# Altium project GrandMini_v1.PrjPcb (part 1 of 2)
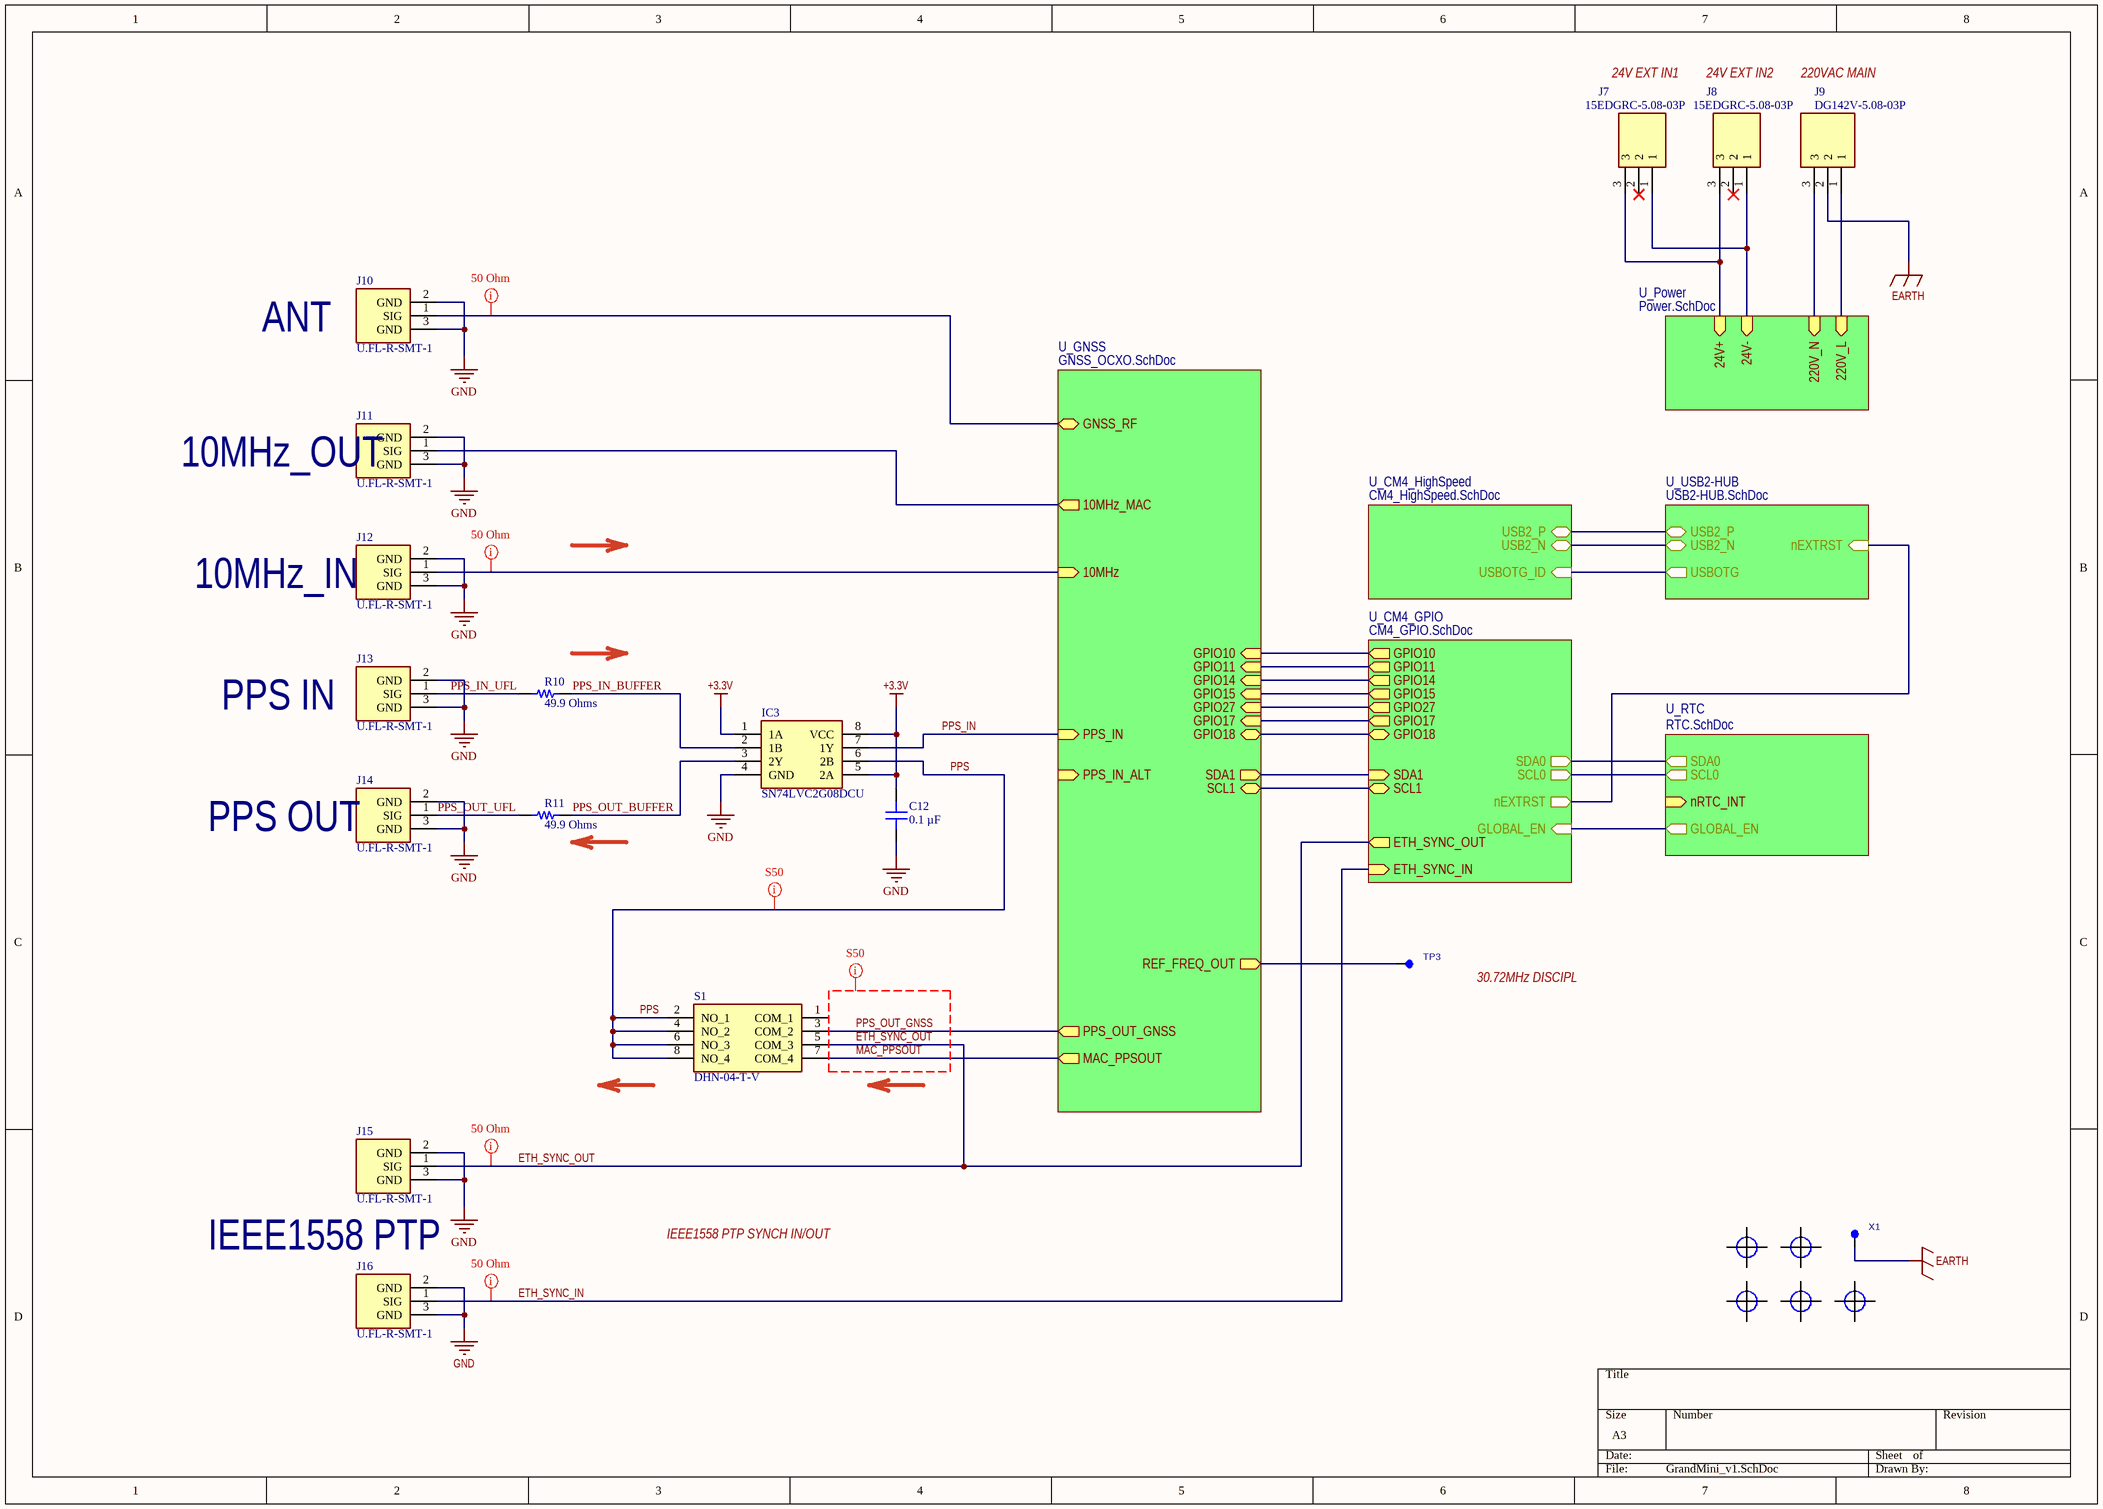
[diagram p0: GrandMini_v1.SchDoc]
company: SHIWA  NETWORK; revision: rev.1.0; TENSH_FAB: ТЕНШ.467883.02.11.000; TENSH_PCB: ТЕНШ.467883.02.11.001
4 sheets, 114 parts. Net scope: hierarchical (ports join the sheet entries above them; power ports are global).
Board file: GrandMini_v1.PcbDoc
Sheets:
  GrandMini_v1.SchDoc
    U_CM4_GPIO = CM4_GPIO.SchDoc
    U_CM4_HighSpeed = CM4_HighSpeed.SchDoc
    U_GNSS = GNSS_OCXO.SchDoc

## Sheet GrandMini_v1.SchDoc
size A3; DocumentNumber: 1; SheetNumber: 1

### Parts
C12  0.1 µF  [CAP 0603_1608]
IC3  SN74LVC2G08DCU  [SOP50P310X90-8N]
J7  15EDGRC-5.08-03P  [15EDGRC-5.08-03P]
J8  15EDGRC-5.08-03P  [15EDGRC-5.08-03P]
J9  DG142V-5.08-03P  [DG142V-5.08-03P]
J10  U.FL-R-SMT-1  [U.FL-R-SMT-1]
J11  U.FL-R-SMT-1  [U.FL-R-SMT-1]
J12  U.FL-R-SMT-1  [U.FL-R-SMT-1]
J13  U.FL-R-SMT-1  [U.FL-R-SMT-1]
J14  U.FL-R-SMT-1  [U.FL-R-SMT-1]
J15  U.FL-R-SMT-1  [U.FL-R-SMT-1]
J16  U.FL-R-SMT-1  [U.FL-R-SMT-1]
MNT1  MOUNT_HOLE  [MOUNT_3.5mm]  (value not drawn)  (no BOM)
MNT2  MOUNT_HOLE  [MOUNT_3.5mm]  (value not drawn)  (no BOM)
MNT4  MOUNT_HOLE  [MOUNT_3.5mm]  (value not drawn)  (no BOM)
MNT5  MOUNT_HOLE  [MOUNT_3.5mm]  (value not drawn)  (no BOM)
MNT6  MOUNT_HOLE  [MOUNT_3.5mm]  (value not drawn)  (no BOM)
R10  49.9 Ohms  [YAGEO RES 0603_1608]
R11  49.9 Ohms  [YAGEO RES 0603_1608]
S1  DHN-04-T-V  [DHN04TV]
TP3  30.72MHz  [PAD_TEST]  (value not drawn)  (no BOM)
X1  PAD  [POWERPAD_ROU_7/3.2]  (value not drawn)  (no BOM)

### Sub-sheets
U_CM4_GPIO = CM4_GPIO.SchDoc: GLOBAL_EN (in), SCL0 (out), SDA0 (out), nEXTRST (out), SDA1 (in), SCL1 (bidir), ETH_SYNC_IN (in), ETH_SYNC_OUT (out), GPIO10 (out), GPIO11 (out), GPIO14 (out), GPIO15 (out), GPIO27 (out), GPIO17 (out), GPIO18 (bidir)
U_CM4_HighSpeed = CM4_HighSpeed.SchDoc: USBOTG_ID (in), USB2_P (bidir), USB2_N (bidir)
U_GNSS = GNSS_OCXO.SchDoc: 10MHz (in), GNSS_RF (bidir), PPS_IN_ALT (in), PPS_IN (in), GPIO17 (in), GPIO27 (in), GPIO11 (in), GPIO10 (in), REF_FREQ_OUT (out), PPS_OUT_GNSS (out), MAC_PPSOUT (out), GPIO15 (in), GPIO14 (in), GPIO18 (bidir), SDA1 (out), SCL1 (bidir), 10MHz_MAC (out)
U_Power = Power.SchDoc (file not in this document): 220V_L (in), 220V_N (in), 24V+ (in), 24V- (in)
U_RTC = RTC.SchDoc (file not in this document): SCL0 (out), SDA0 (out), GLOBAL_EN (out), nRTC_INT (in)
U_USB2-HUB = USB2-HUB.SchDoc (file not in this document): USB2_N (bidir), USBOTG (out), USB2_P (bidir), nEXTRST (in)

### Nets
+3.3V: C12.2 IC3.1(1A) IC3.5(2A) IC3.8(VCC)
EARTH: J9.2 X1.1
GND: C12.1 IC3.4(GND) J10.2(GND) J10.3(GND) J11.2(GND) J11.3(GND) J12.2(GND) J12.3(GND) J13.2(GND) J13.3(GND) J14.2(GND) J14.3(GND) J15.2(GND) J15.3(GND) J16.2(GND) J16.3(GND)
10MHz: J12.1(SIG) ; sheet U_GNSS/10MHz
10MHz_MAC: J11.1(SIG) ; sheet U_GNSS/10MHz_MAC
ETH_SYNC_IN: J16.1(SIG) ; sheet U_CM4_GPIO/ETH_SYNC_IN
ETH_SYNC_OUT: J15.1(SIG) S1.5(COM_3) ; sheet U_CM4_GPIO/ETH_SYNC_OUT
GLOBAL_EN: sheet U_CM4_GPIO/GLOBAL_EN, sheet U_RTC/GLOBAL_EN
GNSS_RF_IN: J10.1(SIG) ; sheet U_GNSS/GNSS_RF
GPIO10: sheet U_CM4_GPIO/GPIO10, sheet U_GNSS/GPIO10
GPIO11: sheet U_CM4_GPIO/GPIO11, sheet U_GNSS/GPIO11
GPIO14: sheet U_CM4_GPIO/GPIO14, sheet U_GNSS/GPIO14
GPIO15: sheet U_CM4_GPIO/GPIO15, sheet U_GNSS/GPIO15
GPIO17: sheet U_CM4_GPIO/GPIO17, sheet U_GNSS/GPIO17
GPIO18: sheet U_CM4_GPIO/GPIO18, sheet U_GNSS/GPIO18
GPIO27: sheet U_CM4_GPIO/GPIO27, sheet U_GNSS/GPIO27
MAC_PPSOUT: S1.7(COM_4) ; sheet U_GNSS/MAC_PPSOUT
nEXTRST: sheet U_CM4_GPIO/nEXTRST, sheet U_USB2-HUB/nEXTRST
PPS: IC3.6(2B) S1.2(NO_1) S1.4(NO_2) S1.6(NO_3) S1.8(NO_4)
PPS_IN: IC3.7(1Y) ; sheet U_GNSS/PPS_IN
PPS_IN_BUFFER: IC3.2(1B) R10.2
PPS_IN_UFL: J13.1(SIG) R10.1
PPS_OUT_BUFFER: IC3.3(2Y) R11.2
PPS_OUT_GNSS: S1.3(COM_2) ; sheet U_GNSS/PPS_OUT_GNSS
PPS_OUT_UFL: J14.1(SIG) R11.1
REF_FREQ_OUT: TP3.1 ; sheet U_GNSS/REF_FREQ_OUT
SCL0: sheet U_CM4_GPIO/SCL0, sheet U_RTC/SCL0
SCL1: sheet U_CM4_GPIO/SCL1, sheet U_GNSS/SCL1
SDA0: sheet U_CM4_GPIO/SDA0, sheet U_RTC/SDA0
SDA1: sheet U_CM4_GPIO/SDA1, sheet U_GNSS/SDA1
USB2_N: sheet U_CM4_HighSpeed/USB2_N, sheet U_USB2-HUB/USB2_N
USB2_P: sheet U_CM4_HighSpeed/USB2_P, sheet U_USB2-HUB/USB2_P
USBOTG_ID: sheet U_CM4_HighSpeed/USBOTG_ID, sheet U_USB2-HUB/USBOTG
NetJ7_1: J7.1 J8.1 ; sheet U_Power/24V-
NetJ7_3: J7.3 J8.3 ; sheet U_Power/24V+
NetJ9_1: J9.1 ; sheet U_Power/220V_L
NetJ9_3: J9.3 ; sheet U_Power/220V_N

Not connected (* = marked no-connect by the designer): J7 2*; J8 2*; S1 1(COM_1)

### Layout directives
net class RF: 10MHz, ETH_SYNC_IN, ETH_SYNC_OUT, GNSS_RF_IN
net class S50: ETH_SYNC_OUT, MAC_PPSOUT, PPS, PPS_OUT_GNSS

### Notes on the sheet
- 24V EXT IN1
- 24V EXT IN2
- 220VAC MAIN
- ANT
- (near J11) 10MHz_OUT
- (near J12) 10MHz_IN
- PPS IN
- (near J14) PPS OUT
- (near TP3) 30.72MHz DISCIPL
- IEEE1558 PTP
- IEEE1558 PTP SYNCH IN/OUT
- 1
- 2
- 3
- 4
- 5
- 6
- A
- B
- C
- www.raspberrypi.com <http://www.raspberrypi.com>
- D
- Title: Compute Module 4 IO Board - Top Level
- File: CM4IOv5.kicad_sch
- Sheet: /
- © 2020-2022 Raspberry Pi Ltd (formerly Raspberry Pi (Trading) Ltd.)
- KiCad E.D.A.  kicad (5.1.4)-1
- Size: A4
- Date:
- Rev: 1
- Id: 1/1

### Library data of the parts
C12 = CC0603KRX7R9BB104: CAP CER 0.1UF 50V X7R 0603; manufacturer: Yageo; Tolerance: ±10%; componentlink2url: https://www.digikey.com/en/products/detail/yageo/CC0603KRX7R9BB104/2103082; Value: 0.1 µF; componentlink2description: DigiKey Link; Temperature Coefficient: X7R; Capacitance: 0.1 µF; Part Number: CC0603KRX7R9BB104; Applications: General Purpose; componentlink1description: Datasheet; componentlink1url: https://www.yageo.com/upload/media/product/productsearch/datasheet/mlcc/UPY-GPHC_X7R_6.3V-to-50V_18.pdf; Device Package: 0603 (1608 Metric); lastupdated: 09.02.2024 20:10:21; Lifecycle Status: Active; Minimum Order: 1; Mounting Type: Surface Mount, MLCC; Operating Temperature: -55°C ~ 125°C; Package / Case: 0603 (1608 Metric); packaging: TapeAndReel; partid: 9506; Part Status: Active; price: 0.01; series: CC; Size / Dimension: 0.063" L x 0.031" W (1.60mm x 0.80mm); Supplier 1: DigiKey; Supplier Part Number 1: 311-1344-1-ND; Thickness (Max): 0.035" (0.90mm); Voltage - Rated: 50V
IC3 = SN74LVC2G08DCU: Integrated Circuit; Manufacturer_Name: Texas Instruments; Datasheet Link: https://datasheet.datasheetarchive.com/originals/distributors/Datasheets-SFU2/DSASFU100028333.pdf; Height: 0.9mm; Manufacturer_Part_Number: SN74LVC2G08DCU
J7 J8 = 15EDGRC-5.08-03P: Connector; Manufacturer_Name: Degson; Manufacturer_Part_Number: 15EDGRC-5.08-02P-14-00A(H); Height: 7.24mm
J9 = DG142V-5.08-03P_1: Connector; pin to pad: 1>1+4 2>2+5 3>3+6; Manufacturer_Name: Degson; Manufacturer_Part_Number: DG142V-5.08-02P; Datasheet Link: https://oss.degson.com/upload/pdf/20211003/20211003190604_7549.pdf; Height: 14.1mm
J10-J16 = U.FL-R-SMT-1: Connector; Manufacturer_Name: Hirose; Height: 1.5; Manufacturer_Part_Number: U.FL-R-SMT-1
MNT1 MNT2 MNT4-MNT6 = MOUNT_HOLE: Mount hole
R10 R11 = RC0603FR-0749R9L: RES 49.9 OHM 1% 1/10W 0603; Manufacturer: Yageo; Power (Watts): 0.1W, 1/10W; Temperature Coefficient: ±100ppm/°C; Packaging: CutTape; ComponentLink2Description: DigiKey Link; ComponentLink1Description: Datasheet; ComponentLink2URL: https://www.digikey.com/en/products/detail/yageo/RC0603FR-0749R9L/727264; ComponentLink1URL: https://www.yageo.com/upload/media/product/productsearch/datasheet/rchip/PYu-RC_Group_51_RoHS_L_10.pdf; Part Number: RC0603FR-0749R9L; Value: 49.9 Ohms; Composition: Thick Film; Device Package: 0603 (1608 Metric); Features: Moisture Resistant; Height - Seated (Max): 0.022" (0.55mm); LastUpdated: 25.07.2024 9:19:17; Lifecycle Status: Active; Minimum Order: 1; Number of Terminations: 2; Operating Temperature: -55°C ~ 155°C; Package / Case: 0603 (1608 Metric); PartId: 23951; Part Status: Active; Price: 0.01; Resistance: 49.9 Ohms; Series: RC_L; Size / Dimension: 0.063" L x 0.031" W (1.60mm x 0.80mm); Supplier 1: DigiKey; Supplier Part Number 1: 311-49.9HRCT-ND; Supplier Device Package: 0603; Tolerance: ±1%
S1 = DHN-04-T-V: Switch; Manufacturer_Name: Diptronics; Datasheet Link: https://componentsearchengine.com/Datasheets/1/DHN-04-T-V.pdf; Height: 1.65mm; Manufacturer_Part_Number: DHN-04-T-V; Mouser Part Number: 113-DHN04TV; Mouser Price/Stock: https://www.mouser.co.uk/ProductDetail/Diptronics/DHN-04-T-V?qs=MLItCLRbWswbt%252B1%2FkyC9JQ%3D%3D
TP3 = PAD_TEST: Test Point; Manufacturer: {Manufacturer}; Reseller3: {Reseller3}; Reseller1: {Reseller1}; Tempcoeff: {Tempcoeff}; Reseller2: {Reseller2}; Tolerance: {Tolerance}; Value: .NetName; PowerVoltage: {PowerVoltage}; CatalogueCode: {CatalogueCode}; Case: {Case}
X1 = PAD: Power Pad; Manufacturer: {Manufacturer}; Reseller3: {Reseller3}; Reseller1: {Reseller1}; Tempcoeff: {Tempcoeff}; Reseller2: {Reseller2}; Tolerance: {Tolerance}; Value: {Value}; PowerVoltage: {PowerVoltage}; CatalogueCode: {CatalogueCode}; Case: {Case}

## Sheet CM4_GPIO.SchDoc
size A3; DocumentNumber: 2; SheetNumber: 2
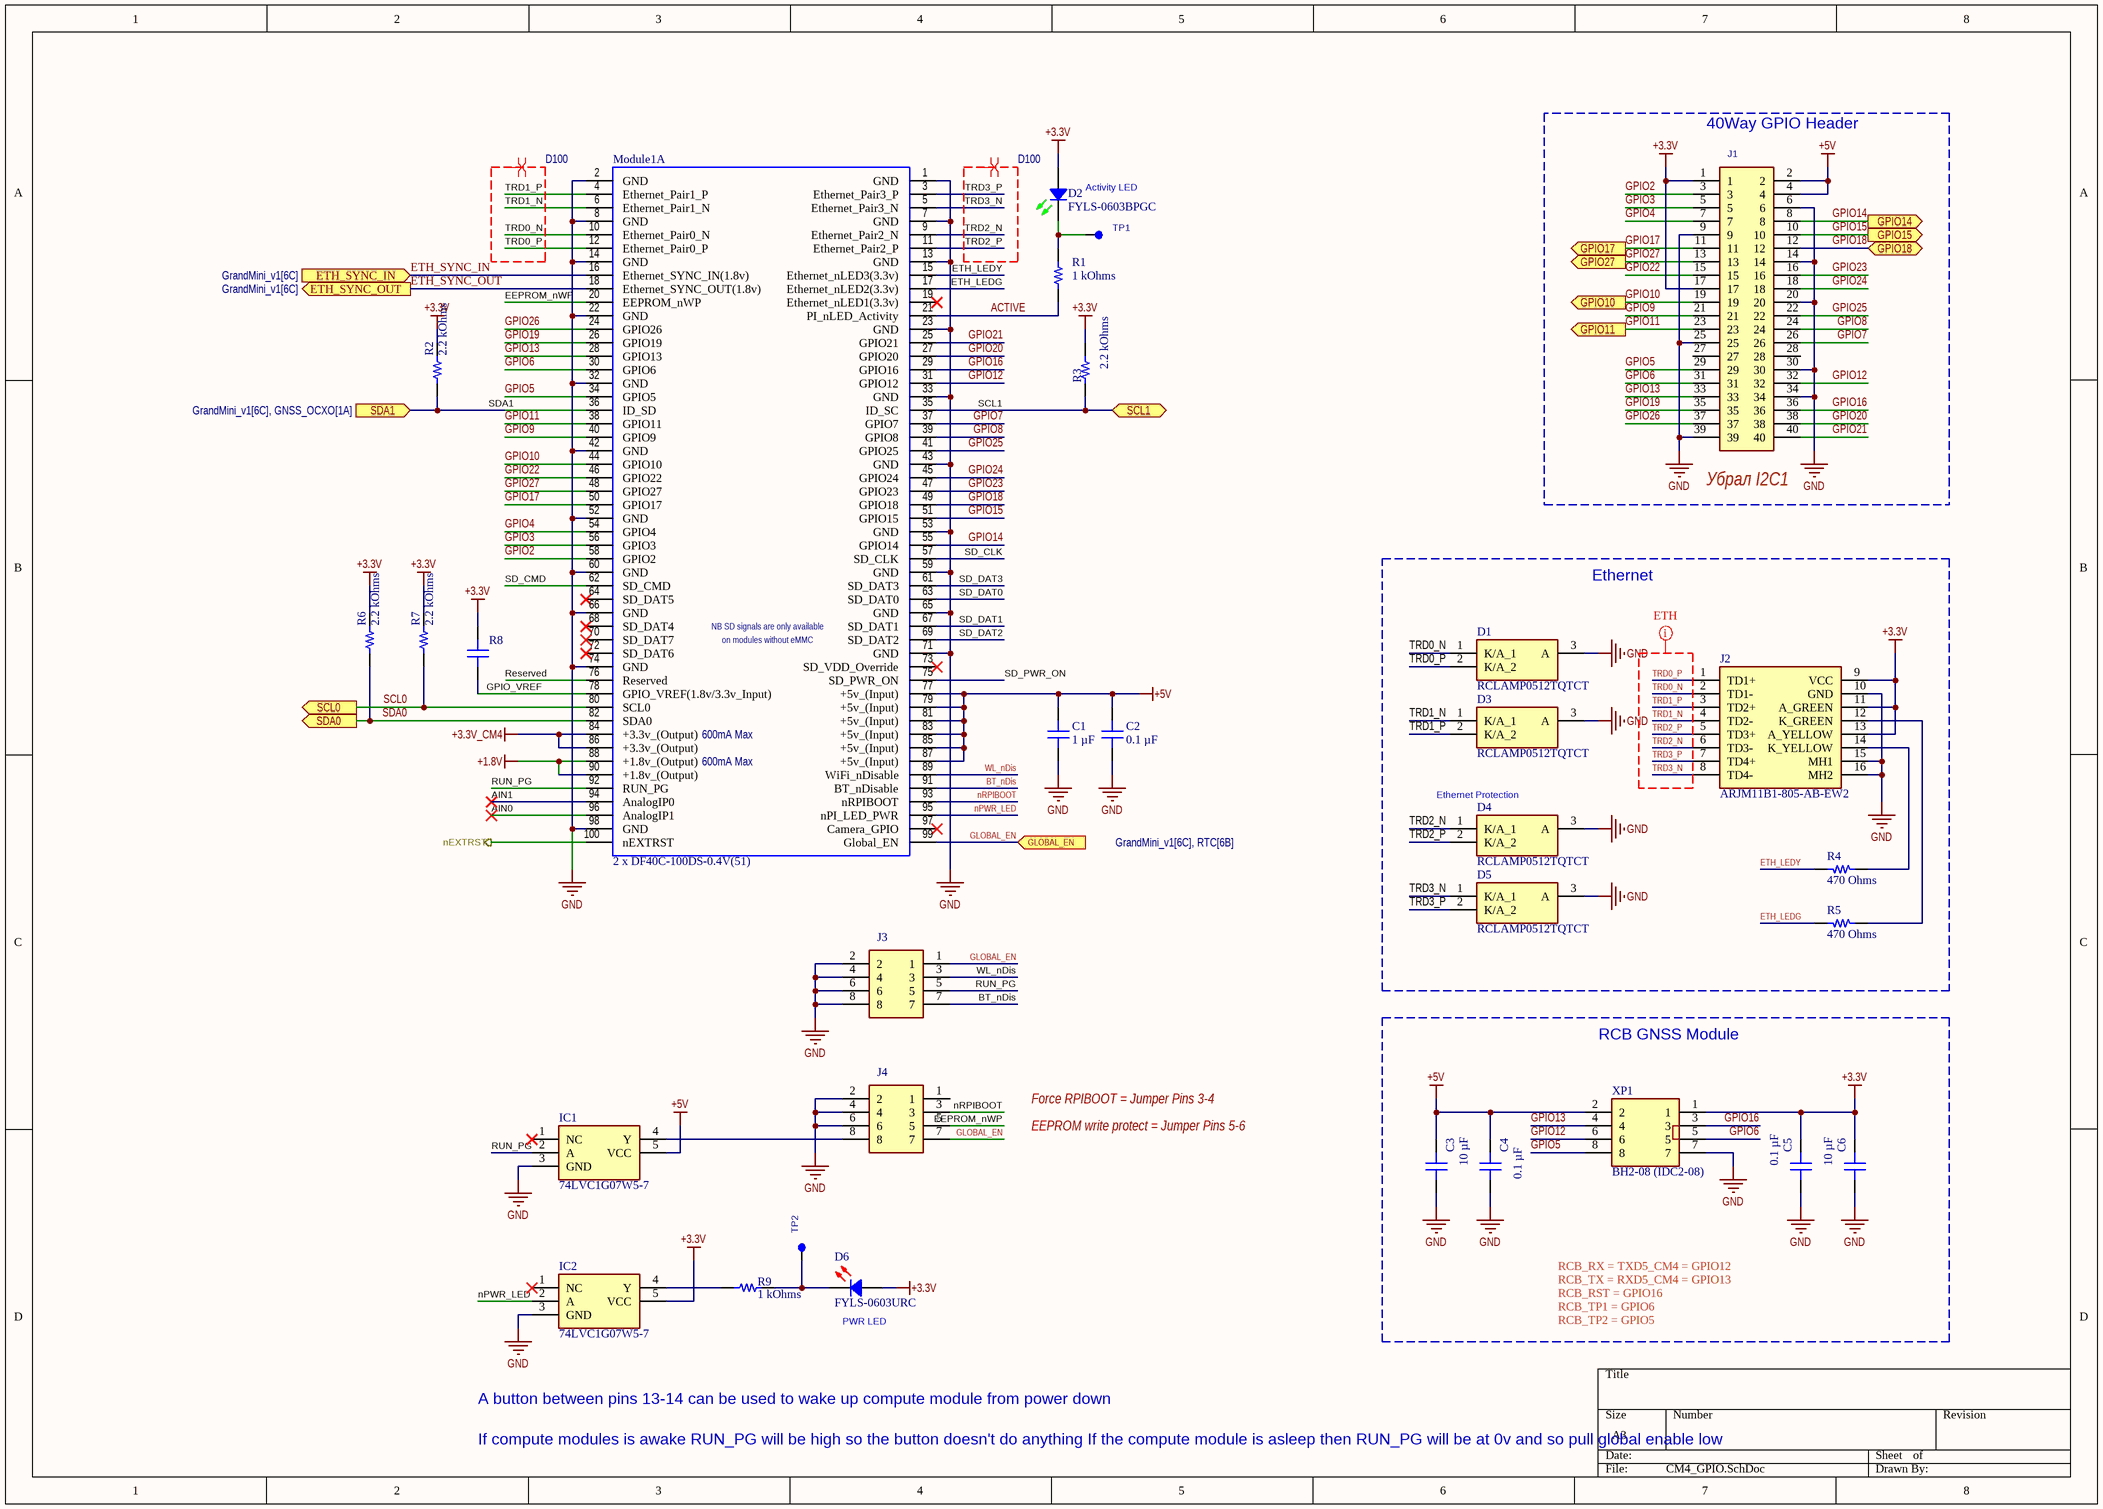
[diagram p1: CM4_GPIO.SchDoc]

### Parts
C1  1 µF  [CAP 0603_1608]
C2  0.1 µF  [CAP 0603_1608]
C3  10 µF  [CAP 0805_2012]
C4  0.1 µF  [CAP 0603_1608]
C5  0.1 µF  [CAP 0603_1608]
C6  10 µF  [CAP 0805_2012]
D1  RCLAMP0512TQTCT  [RCLAMP0512TQTCT]
D2  FYLS-0603BPGC  [LEDC1608X55N_GREEN]
D3  RCLAMP0512TQTCT  [RCLAMP0512TQTCT]
D4  RCLAMP0512TQTCT  [RCLAMP0512TQTCT]
D5  RCLAMP0512TQTCT  [RCLAMP0512TQTCT]
D6  FYLS-0603URC  [LEDC1608X55N_RED]
IC1  74LVC1G07W5-7  [SOT95P285X140-5N]
IC2  74LVC1G07W5-7  [SOT95P285X140-5N]
J1  PBD-40  [PBD-40]  (value not drawn)
J2  ARJM11B1-805-AB-EW2  [ARJM11B1805ABEW2]
J3  PLD-8  [PLD-8]  (value not drawn)
J4  PLD-8  [PLD-8]  (value not drawn)
Module1  2 x DF40C-100DS-0.4V(51)  [RPI_CM4_STACKED]  (part A of 2)
R1  1 kOhms  [YAGEO RES 0603_1608]
R2  2.2 kOhms  [YAGEO RES 0402_1005]
R3  2.2 kOhms  [YAGEO RES 0402_1005]
R4  470 Ohms  [YAGEO RES 0402_1005]
R5  470 Ohms  [YAGEO RES 0402_1005]
R6  2.2 kOhms  [YAGEO RES 0402_1005]
R7  2.2 kOhms  [YAGEO RES 0402_1005]
R8  10 µF  [CAP 0805_2012]  (value not drawn)
R9  1 kOhms  [YAGEO RES 0603_1608]
TP1  PAD_TEST  [PAD_TEST]  (value not drawn)  (no BOM)
TP2  PAD_TEST  [PAD_TEST]  (value not drawn)  (no BOM)
XP1  BH2-08 (IDC2-08)  [BH2-08]

### Blocks framed on the sheet
Убрал I2C1: J1
Ethernet: D1 D3-D5 J2 R4 R5
RCB GNSS Module: C3-C6 XP1

### Ports
ETH_SYNC_IN (in, see GrandMini_v1[6C]), ETH_SYNC_OUT (out, see GrandMini_v1[6C]), GLOBAL_EN (in, see GrandMini_v1[6C], RTC[6B]), GPIO10 (out, see GrandMini_v1[6B], GNSS_OCXO[3A]), GPIO11 (out, see GrandMini_v1[6B], GNSS_OCXO[3A]), GPIO14 (out, see GrandMini_v1[6B], GNSS_OCXO[3A]), GPIO15 (out, see GrandMini_v1[6B], GNSS_OCXO[3A]), GPIO17 (out, see GrandMini_v1[6B], GNSS_OCXO[1B]), GPIO18 (bidir, see GrandMini_v1[6B], GNSS_OCXO[3A]), GPIO27 (out, see GrandMini_v1[6B], GNSS_OCXO[1B]), nEXTRST (out, see GrandMini_v1[6C], USB2-HUB[1B]), SCL0 (out, see GrandMini_v1[6C], RTC[3A]), SCL1 (bidir, see GrandMini_v1[6C], GNSS_OCXO[1A]), SDA0 (out, see GrandMini_v1[6C], RTC[3B]), SDA1 (in, see GrandMini_v1[6C], GNSS_OCXO[1A])

### Nets
+1.8V: Module1.88(+1.8v_(Output)) Module1.90(+1.8v_(Output))
+3.3V: C5.2 C6.2 D2.2(C) D6.2(C) IC2.5(VCC) J1.1 J1.17 J2.9(VCC) J2.11(A_GREEN) J2.13(A_YELLOW) R2.2 R3.2 R6.2 R7.2 R8.2 XP1.1
+3.3V_CM4: Module1.84(+3.3v_(Output)) Module1.86(+3.3v_(Output))
+5V: C1.2 C2.2 C3.2 C4.2 IC1.5(VCC) J1.2 J1.4 Module1.77(+5v_(Input)) Module1.79(+5v_(Input)) Module1.81(+5v_(Input)) Module1.83(+5v_(Input)) Module1.85(+5v_(Input)) Module1.87(+5v_(Input)) XP1.2
GND: C1.1 C2.1 C3.1 C4.1 C5.1 C6.1 D1.3(A) D3.3(A) D4.3(A) D5.3(A) IC1.3(GND) IC2.3(GND) J1.6 J1.9 J1.14 J1.20 J1.25 J1.30 J1.34 J1.39 J2.10(GND) J2.15(MH1) J2.16(MH2) J3.2 J3.4 J3.6 J3.8 J4.2 J4.4 J4.6 Module1.1(GND) Module1.2(GND) Module1.7(GND) Module1.8(GND) Module1.13(GND) Module1.14(GND) Module1.22(GND) Module1.23(GND) Module1.32(GND) Module1.33(GND) Module1.42(GND) Module1.43(GND) Module1.52(GND) Module1.53(GND) Module1.59(GND) Module1.60(GND) Module1.65(GND) Module1.66(GND) Module1.71(GND) Module1.74(GND) Module1.98(GND) XP1.7
ACTIVE: Module1.21(PI_nLED_Activity) R1.1
AIN0: Module1.96(AnalogIP1)
AIN1: Module1.94(AnalogIP0)
BT_nDis: J3.7 Module1.91(BT_nDisable)
EEPROM_nWP: J4.5 Module1.20(EEPROM_nWP)
ETH_LEDG: Module1.17(Ethernet_nLED2(3.3v)) R5.2
ETH_LEDY: Module1.15(Ethernet_nLED3(3.3v)) R4.2
ETH_SYNC_IN: Module1.16(Ethernet_SYNC_IN(1.8v)) ; port ETH_SYNC_IN
ETH_SYNC_OUT: Module1.18(Ethernet_SYNC_OUT(1.8v)) ; port ETH_SYNC_OUT
GLOBAL_EN: J3.1 J4.7 Module1.99(Global_EN) ; port GLOBAL_EN
GPIO2: J1.3 Module1.58(GPIO2)
GPIO3: J1.5 Module1.56(GPIO3)
GPIO4: J1.7 Module1.54(GPIO4)
GPIO5: J1.29 Module1.34(GPIO5) XP1.8
GPIO6: J1.31 Module1.30(GPIO6) XP1.5
GPIO7: J1.26 Module1.37(GPIO7)
GPIO8: J1.24 Module1.39(GPIO8)
GPIO9: J1.21 Module1.40(GPIO9)
GPIO10: J1.19 Module1.44(GPIO10) ; port GPIO10
GPIO11: J1.23 Module1.38(GPIO11) ; port GPIO11
GPIO12: J1.32 Module1.31(GPIO12) XP1.6
GPIO13: J1.33 Module1.28(GPIO13) XP1.4
GPIO14: J1.8 Module1.55(GPIO14) ; port GPIO14
GPIO15: J1.10 Module1.51(GPIO15) ; port GPIO15
GPIO16: J1.36 Module1.29(GPIO16) XP1.3
GPIO17: J1.11 Module1.50(GPIO17) ; port GPIO17
GPIO18: J1.12 Module1.49(GPIO18) ; port GPIO18
GPIO19: J1.35 Module1.26(GPIO19)
GPIO20: J1.38 Module1.27(GPIO20)
GPIO21: J1.40 Module1.25(GPIO21)
GPIO22: J1.15 Module1.46(GPIO22)
GPIO23: J1.16 Module1.47(GPIO23)
GPIO24: J1.18 Module1.45(GPIO24)
GPIO25: J1.22 Module1.41(GPIO25)
GPIO26: J1.37 Module1.24(GPIO26)
GPIO27: J1.13 Module1.48(GPIO27) ; port GPIO27
GPIO_VREF: Module1.78(GPIO_VREF(1.8v/3.3v_Input)) R8.1
nEXTRST: Module1.100(nEXTRST) ; port nEXTRST
nPWR_LED: IC2.2(A) Module1.95(nPI_LED_PWR)
nRPIBOOT: J4.3 Module1.93(nRPIBOOT)
RUN_PG: IC1.2(A) J3.5 Module1.92(RUN_PG)
SCL0: Module1.80(SCL0) R7.1 ; port SCL0
SCL1: Module1.35(ID_SC) R3.1 ; port SCL1
SD_CLK: Module1.57(SD_CLK)
SD_CMD: Module1.62(SD_CMD)
SD_DAT0: Module1.63(SD_DAT0)
SD_DAT1: Module1.67(SD_DAT1)
SD_DAT2: Module1.69(SD_DAT2)
SD_DAT3: Module1.61(SD_DAT3)
SD_PWR_ON: Module1.75(SD_PWR_ON)
SDA0: Module1.82(SDA0) R6.1 ; port SDA0
SDA1: Module1.36(ID_SD) R2.1 ; port SDA1
TRD0_N: D1.1(K/A_1) J2.2(TD1-) Module1.10(Ethernet_Pair0_N)
TRD0_P: D1.2(K/A_2) J2.1(TD1+) Module1.12(Ethernet_Pair0_P)
TRD1_N: D3.1(K/A_1) J2.4(TD2-) Module1.6(Ethernet_Pair1_N)
TRD1_P: D3.2(K/A_2) J2.3(TD2+) Module1.4(Ethernet_Pair1_P)
TRD2_N: D4.1(K/A_1) J2.6(TD3-) Module1.9(Ethernet_Pair2_N)
TRD2_P: D4.2(K/A_2) J2.5(TD3+) Module1.11(Ethernet_Pair2_P)
TRD3_N: D5.1(K/A_1) J2.8(TD4-) Module1.5(Ethernet_Pair3_N)
TRD3_P: D5.2(K/A_2) J2.7(TD4+) Module1.3(Ethernet_Pair3_P)
WL_nDis: J3.3 Module1.89(WiFi_nDisable)
NetD2_1: D2.1(A) R1.2 TP1.1
NetD6_1: D6.1(A) R9.2 TP2.1
NetIC1_4: IC1.4(Y) J4.8
NetIC2_4: IC2.4(Y) R9.1
NetJ2_12: J2.12(K_GREEN) R5.1
NetJ2_14: J2.14(K_YELLOW) R4.1

Not connected (* = marked no-connect by the designer): IC1 1(NC)*; IC2 1(NC)*; J1 27 28; J4 1; Module1 19(Ethernet_nLED1(3.3v))* 64(SD_DAT5)* 68(SD_DAT4)* 70(SD_DAT7)* 72(SD_DAT6)* 73(SD_VDD_Override)* 76(Reserved) 97(Camera_GPIO)*

### Layout directives
differential pair; differential pair class D100: TRD0_N, TRD0_P, TRD1_N, TRD1_P, TRD2_N, TRD2_P, TRD3_N, TRD3_P
net class ETH: TRD0_N, TRD0_P, TRD1_N, TRD1_P, TRD2_N, TRD2_P, TRD3_N, TRD3_P

### Notes on the sheet
- (near J1) 40Way GPIO Header
- Activity LED
- (near D4) Ethernet
  Protection
- Force RPIBOOT = Jumper Pins 3-4
- EEPROM write protect = Jumper Pins 5-6
- (near D6) PWR LED
- RCB_TX = RXD5_CM4 = GPIO13
- RCB_RX = TXD5_CM4 = GPIO12
- RCB_RST = GPIO16
- RCB_TP1 = GPIO6
- RCB_TP2 = GPIO5
- A button between pins 13-14 can be used to wake up compute module from power down
- If compute modules is awake RUN_PG will be high so the button doesn't do anything
  If the compute module is asleep then RUN_PG will be at 0v and so pull global enable low
- Labels drawn without touching a wire or pin: Reserved
- 1
- 2
- 3
- 4
- 5
- 6
- A
- B
- C
- www.raspberrypi.com <http://www.raspberrypi.com>
- D
- Title: Compute Module 4 IO Board - GPIO - Ethernet
- File: CM4_GPIO.kicad_sch
- Sheet: /
- © 2020-2022 Raspberry Pi Ltd (formerly Raspberry Pi (Trading) Ltd.)
- KiCad E.D.A.  kicad (5.1.4)-1
- Size: A4
- Date:
- Rev: 1
- Id: 1/1
- (in symbol RPi_CM4_1, part A) NB SD signals are only available; on modules without eMMC; 600mA Max

### Library data of the parts
C1 = CC0603KRX7R9BB105: CAP CER 1UF 50V X7R 0603; manufacturer: Yageo; Tolerance: ±10%; Part Number: CC0603KRX7R9BB105; Value: 1 µF; Applications: General Purpose; Capacitance: 1 µF; componentlink1description: Datasheet; componentlink1url: https://www.yageo.com/upload/media/product/productsearch/datasheet/mlcc/UPY-GPHC_X7R_6.3V-to-50V_20.pdf; componentlink2description: DigiKey Link; componentlink2url: https://www.digikey.com/en/products/detail/yageo/CC0603KRX7R9BB105/5883796; Device Package: 0603 (1608 Metric); lastupdated: 09.02.2024 20:09:49; Lifecycle Status: Active; Minimum Order: 1; Mounting Type: Surface Mount, MLCC; Operating Temperature: -55°C ~ 125°C; Package / Case: 0603 (1608 Metric); packaging: TapeAndReel; partid: 45844; Part Status: Active; price: 0.09; series: CC; Size / Dimension: 0.063" L x 0.031" W (1.60mm x 0.80mm); Supplier 1: DigiKey; Supplier Part Number 1: 311-2082-1-ND; Temperature Coefficient: X7R; Thickness (Max): 0.035" (0.90mm); Voltage - Rated: 50V
C2 C4 C5 = CC0603KRX7R9BB104: as C12 on sheet GrandMini_v1; Part Number: CC0603KRX7R9BB104; Value: 0.1 µF; Applications: General Purpose; Capacitance: 0.1 µF; componentlink1description: Datasheet; componentlink1url: https://www.yageo.com/upload/media/product/productsearch/datasheet/mlcc/UPY-GPHC_X7R_6.3V-to-50V_18.pdf; componentlink2description: DigiKey Link; componentlink2url: https://www.digikey.com/en/products/detail/yageo/CC0603KRX7R9BB104/2103082; Device Package: 0603 (1608 Metric); lastupdated: 09.02.2024 20:10:21; Lifecycle Status: Active; Minimum Order: 1; Mounting Type: Surface Mount, MLCC; Operating Temperature: -55°C ~ 125°C; Package / Case: 0603 (1608 Metric); packaging: TapeAndReel; partid: 9506; Part Status: Active; price: 0.01; series: CC; Size / Dimension: 0.063" L x 0.031" W (1.60mm x 0.80mm); Supplier 1: DigiKey; Supplier Part Number 1: 311-1344-1-ND; Temperature Coefficient: X7R; Thickness (Max): 0.035" (0.90mm); Voltage - Rated: 50V
C3 C6 R8 = CC0805KKX5R8BB106: CAP CER 10UF 25V X5R 0805; manufacturer: Yageo; Tolerance: ±10%; Value: 10 µF; Part Number: CC0805KKX5R8BB106; Applications: General Purpose; Capacitance: 10 µF; componentlink1description: Datasheet; componentlink1url: https://www.yageo.com/upload/media/product/productsearch/datasheet/mlcc/UPY-GPHC_X5R_4V-to-50V_25.pdf; componentlink2description: DigiKey Link; componentlink2url: https://www.digikey.com/en/products/detail/yageo/CC0805KKX5R8BB106/5195275; Device Package: 0805 (2012 Metric); lastupdated: 09.02.2024 20:15:28; Lifecycle Status: Active; Minimum Order: 1; Mounting Type: Surface Mount, MLCC; Operating Temperature: -55°C ~ 85°C; Package / Case: 0805 (2012 Metric); packaging: TapeAndReel; partid: 16151; Part Status: Active; price: 0.06; series: CC; Size / Dimension: 0.079" L x 0.049" W (2.00mm x 1.25mm); Supplier 1: DigiKey; Supplier Part Number 1: 311-1869-1-ND; Temperature Coefficient: X5R; Thickness (Max): 0.057" (1.45mm); Voltage - Rated: 25V
D1 D3-D5 = RCLAMP0512TQTCT: Diode; Manufacturer_Name: SEMTECH; Datasheet Link: https://media.digikey.com/pdf/Data%20Sheets/Semtech%20PDFs/RCLAMP0512TQ_Rev6_12-17-15.pdf; Height: 0.45mm; Manufacturer_Part_Number: RCLAMP0512TQTCT; Mouser Part Number: 947-RCLAMP0512TQTCT; Mouser Price/Stock: https://www.mouser.co.uk/ProductDetail/Semtech/RCLAMP0512TQTCT?qs=rBWM4%252BvDhIfq7vcNOg1BvQ%3D%3D; Arrow Part Number: RCLAMP0512TQTCT; Arrow Price/Stock: https://www.arrow.com/en/products/rclamp0512tqtct/semtech?utm_currency=USD&region=europe
D2 = FYLS-0603BPGC: LED, 0603, GREEN; Manufacturer_Name: FORYARD; Datasheet Link: https://v4.cecdn.yun300.cn/100001_2003185297/7%20FYLS-0603BXXXC-D.pdf; Height: 0.6mm; Manufacturer_Part_Number: FYLS-0603BPGC
D6 = FYLS-0603URC: LED, 0603, RED; Manufacturer_Name: FORYARD; Datasheet Link: https://v4.cecdn.yun300.cn/100001_2003185297/7%20FYLS-0603BXXXC-D.pdf; Height: 0.6mm; Manufacturer_Part_Number: FYLS-0603URC
IC1 IC2 = 74LVC1G07W5-7: Integrated Circuit; Manufacturer_Name: Diodes Incorporated; Datasheet Link: https://www.diodes.com//assets/Datasheets/74LVC1G07.pdf; Height: 1.4mm; Manufacturer_Part_Number: 74LVC1G07W5-7; Mouser Part Number: 621-74LVC1G07W5-7; Mouser Price/Stock: https://www.mouser.co.uk/ProductDetail/Diodes-Incorporated/74LVC1G07W5-7?qs=abZ1nkZpTuMhe1bWQEjvtw%3D%3D; Arrow Part Number: 74LVC1G07W5-7; Arrow Price/Stock: https://www.arrow.com/en/products/74lvc1g07w5-7/diodes-incorporated?utm_currency=USD&region=nac
J1 = PBD-40: Connector; Manufacturer: Connfly; Part Number1: DS-1023-2x20; System: Connector; Part Number: PBD-40
J2 = ARJM11B1-805-AB-EW2: Connector; Manufacturer_Name: ABRACON; Datasheet Link: https://abracon.com/Magnetics/ARJM11.pdf; Height: 13.75mm; Manufacturer_Part_Number: ARJM11B1-805-AB-EW2; Mouser Part Number: 815-RJM11B1805ABEW2; Mouser Price/Stock: https://www.mouser.co.uk/ProductDetail/ABRACON/ARJM11B1-805-AB-EW2?qs=YCa%2FAAYMW02bp%252BSCNzjdNA%3D%3D; Arrow Part Number: ARJM11B1-805-AB-EW2; Arrow Price/Stock: https://www.arrow.com/en/products/arjm11b1-805-ab-ew2/abracon?region=nac
J3 J4 = PLD-8_1: Connector; Manufacturer_Name: JST (JAPAN SOLDERLESS TERMINALS); Manufacturer_Part_Number: S4B-PH-SM4-TB(LF)(SN); Datasheet Link: http://uk.rs-online.com/web/p/products/6881366; Arrow Part Number: S4B-PH-SM4-TB(LF)(SN); Arrow Price/Stock: https://www.arrow.com/en/products/s4b-ph-sm4-tb-lf-sn/jst-manufacturing; System: Connector
Module1 = RPi_CM4_1: Rapsberry PI Compute Module 4 +
R1 R9 = RC0603FR-071KL: RES 1K OHM 1% 1/10W 0603; Manufacturer: Yageo; Power (Watts): 0.1W, 1/10W; Temperature Coefficient: ±100ppm/°C; Value: 1 kOhms; Part Number: RC0603FR-071KL; ComponentLink1Description: Datasheet; ComponentLink1URL: https://www.yageo.com/upload/media/product/productsearch/datasheet/rchip/PYu-RC_Group_51_RoHS_L_10.pdf; ComponentLink2Description: DigiKey Link; ComponentLink2URL: https://www.digikey.com/en/products/detail/yageo/RC0603FR-071KL/726843; Composition: Thick Film; Device Package: 0603 (1608 Metric); Features: Moisture Resistant; Height - Seated (Max): 0.022" (0.55mm); LastUpdated: 25.07.2024 9:19:19; Lifecycle Status: Active; Minimum Order: 1; Number of Terminations: 2; Operating Temperature: -55°C ~ 155°C; Package / Case: 0603 (1608 Metric); Packaging: CutTape; PartId: 22600; Part Status: Active; Price: 0.01; Resistance: 1 kOhms; Series: RC_L; Size / Dimension: 0.063" L x 0.031" W (1.60mm x 0.80mm); Supplier 1: DigiKey; Supplier Part Number 1: 311-1.00KHRCT-ND; Supplier Device Package: 0603; Tolerance: ±1%
R2 R3 R6 R7 = RC0402FR-072K2L: RES 2.2K OHM 1% 1/16W 0402; Manufacturer: Yageo; Power (Watts): 0.063W, 1/16W; Temperature Coefficient: ±100ppm/°C; Part Number: RC0402FR-072K2L; Value: 2.2 kOhms; ComponentLink1Description: Datasheet; ComponentLink1URL: https://www.yageo.com/upload/media/product/productsearch/datasheet/rchip/PYu-RC_Group_51_RoHS_L_10.pdf; ComponentLink2Description: DigiKey Link; ComponentLink2URL: https://www.digikey.com/en/products/detail/yageo/RC0402FR-072K2L/726553; Composition: Thick Film; Device Package: 0402 (1005 Metric); Features: Moisture Resistant; Height - Seated (Max): 0.016" (0.40mm); LastUpdated: 25.07.2024 9:18:11; Lifecycle Status: Active; Minimum Order: 1; Number of Terminations: 2; Operating Temperature: -55°C ~ 155°C; Package / Case: 0402 (1005 Metric); Packaging: CutTape; PartId: 17607; Part Status: Active; Price: 0.01; Resistance: 2.2 kOhms; Series: RC_L; Size / Dimension: 0.039" L x 0.020" W (1.00mm x 0.50mm); Supplier 1: DigiKey; Supplier Part Number 1: 311-2.20KLRCT-ND; Supplier Device Package: 0402; Tolerance: ±1%
R4 R5 = RC0402FR-07470RL: RES 470 OHM 1% 1/16W 0402; Manufacturer: Yageo; Power (Watts): 0.063W, 1/16W; Temperature Coefficient: ±100ppm/°C; Packaging: CutTape; Composition: Thick Film; Tolerance: ±1%; Resistance: 470 Ohms; Value: 470 Ohms; Series: RC_L; Number of Terminations: 2; ComponentLink1URL: https://www.yageo.com/upload/media/product/productsearch/datasheet/rchip/PYu-RC_Group_51_RoHS_L_10.pdf; ComponentLink1Description: Datasheet; ComponentLink2URL: https://www.digikey.com/en/products/detail/yageo/RC0402FR-07470RL/726619; ComponentLink2Description: DigiKey Link; Part Number: RC0402FR-07470RL; Device Package: 0402 (1005 Metric); Features: Moisture Resistant; Height - Seated (Max): 0.016" (0.40mm); LastUpdated: 25.07.2024 9:18:11; Lifecycle Status: Active; Minimum Order: 1; Operating Temperature: -55°C ~ 155°C; Package / Case: 0402 (1005 Metric); PartId: 17923; Part Status: Active; Price: 0.01; Size / Dimension: 0.039" L x 0.020" W (1.00mm x 0.50mm); Supplier 1: DigiKey; Supplier Part Number 1: 311-470LRCT-ND; Supplier Device Package: 0402
TP1 TP2 = PAD_TEST: as TP3 on sheet GrandMini_v1; Case: {Case}
XP1 = BH2-08: Connector; Manufacturer_Name: Connfly; Manufacturer_Part_Number: DS1014-08; Manufacturer_Part_Number_1: IDC2-08MS; Datasheet Link: https://static.chipdip.ru/lib/463/DOC002463525.pdf; System: Connector

## Sheet CM4_HighSpeed.SchDoc
size A4; DocumentNumber: 3; SheetNumber: 3
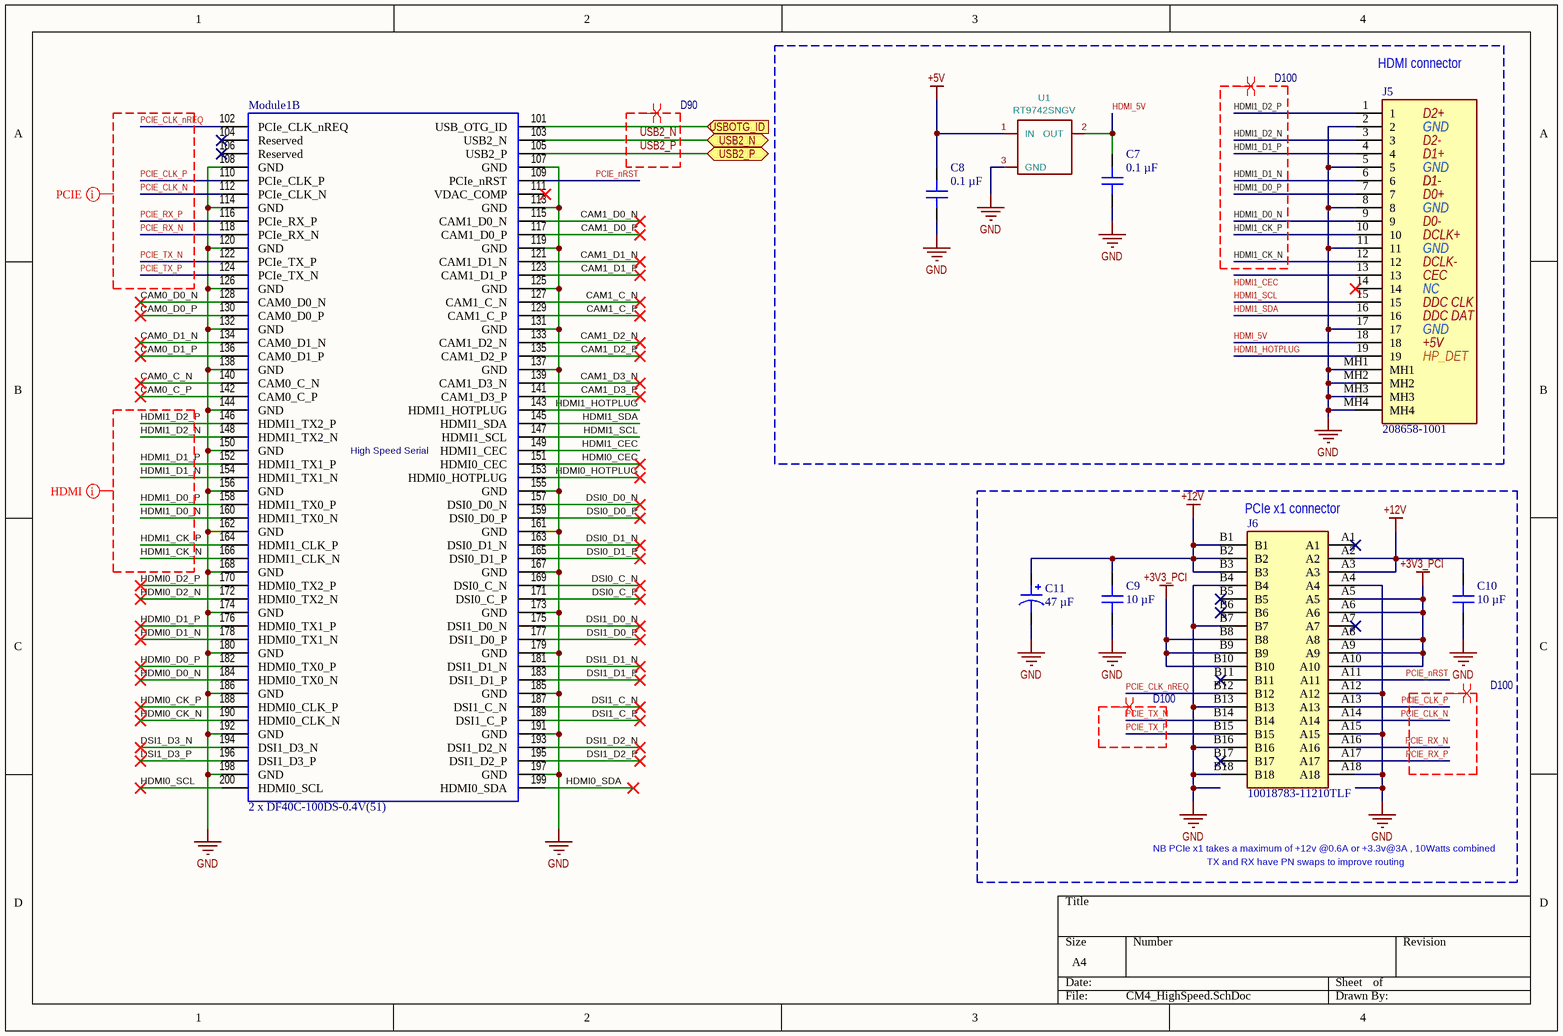
[diagram p2: CM4_HighSpeed.SchDoc]

### Parts
C7  0.1 µF  [CAP 0603_1608]
C8  0.1 µF  [CAP 0603_1608]
C9  10 µF  [CAP 0805_2012]
C10  10 µF  [CAP 0805_2012]
C11  47 µF  [CAP POL 2917_7343]
J5  208658-1001  [2086581001]
J6  10018783-11210TLF  [1001878311210TLF]
Module1  2 x DF40C-100DS-0.4V(51)  [RPI_CM4_STACKED]  (part B of 2)
U1  RT9742SNGV  [SOT-23]

### Blocks framed on the sheet
HDMI connector: C7 C8 J5 U1
PCIe x1 connector: C9-C11 J6

### Ports
USB2_N (bidir, see GrandMini_v1[6B], USB2-HUB[1B]), USB2_P (bidir, see GrandMini_v1[6B], USB2-HUB[1B]), USBOTG_ID (in, see GrandMini_v1[6B])

### Nets
+3V3_PCI: J6.A5 J6.A6 J6.A8 J6.A9 J6.A10 J6.B8 J6.B9 J6.B10
+5V: C8.2 U1.1(IN)
+12V: C9.2 C10.2 C11.1 J6.A2 J6.A3 J6.B1 J6.B2 J6.B3
GND: C7.1 C8.1 C9.1 C10.1 C11.2 J5.2 J5.5 J5.8 J5.11 J5.17 J5.MH1 J5.MH2 J5.MH3 J5.MH4 J6.A4 J6.A12 J6.A15 J6.A18 J6.B4 J6.B7 J6.B13 J6.B16 J6.B18 Module1.107(GND) Module1.108(GND) Module1.113(GND) Module1.114(GND) Module1.119(GND) Module1.120(GND) Module1.125(GND) Module1.126(GND) Module1.131(GND) Module1.132(GND) Module1.137(GND) Module1.138(GND) Module1.144(GND) Module1.150(GND) Module1.155(GND) Module1.156(GND) Module1.161(GND) Module1.162(GND) Module1.167(GND) Module1.168(GND) Module1.173(GND) Module1.174(GND) Module1.179(GND) Module1.180(GND) Module1.185(GND) Module1.186(GND) Module1.191(GND) Module1.192(GND) Module1.197(GND) Module1.198(GND) U1.3(GND)
CAM0_C_N: Module1.140(CAM0_C_N)
CAM0_C_P: Module1.142(CAM0_C_P)
CAM0_D0_N: Module1.128(CAM0_D0_N)
CAM0_D0_P: Module1.130(CAM0_D0_P)
CAM0_D1_N: Module1.134(CAM0_D1_N)
CAM0_D1_P: Module1.136(CAM0_D1_P)
CAM1_C_N: Module1.127(CAM1_C_N)
CAM1_C_P: Module1.129(CAM1_C_P)
CAM1_D0_N: Module1.115(CAM1_D0_N)
CAM1_D0_P: Module1.117(CAM1_D0_P)
CAM1_D1_N: Module1.121(CAM1_D1_N)
CAM1_D1_P: Module1.123(CAM1_D1_P)
CAM1_D2_N: Module1.133(CAM1_D2_N)
CAM1_D2_P: Module1.135(CAM1_D2_P)
CAM1_D3_N: Module1.139(CAM1_D3_N)
CAM1_D3_P: Module1.141(CAM1_D3_P)
DSI0_C_N: Module1.169(DSI0_C_N)
DSI0_C_P: Module1.171(DSI0_C_P)
DSI0_D0_N: Module1.157(DSI0_D0_N)
DSI0_D0_P: Module1.159(DSI0_D0_P)
DSI0_D1_N: Module1.163(DSI0_D1_N)
DSI0_D1_P: Module1.165(DSI0_D1_P)
DSI1_C_N: Module1.187(DSI1_C_N)
DSI1_C_P: Module1.189(DSI1_C_P)
DSI1_D0_N: Module1.175(DSI1_D0_N)
DSI1_D0_P: Module1.177(DSI1_D0_P)
DSI1_D1_N: Module1.181(DSI1_D1_N)
DSI1_D1_P: Module1.183(DSI1_D1_P)
DSI1_D2_N: Module1.193(DSI1_D2_N)
DSI1_D2_P: Module1.195(DSI1_D2_P)
DSI1_D3_N: Module1.194(DSI1_D3_N)
DSI1_D3_P: Module1.196(DSI1_D3_P)
HDMI0_CEC: Module1.151(HDMI0_CEC)
HDMI0_CK_N: Module1.190(HDMI0_CLK_N)
HDMI0_CK_P: Module1.188(HDMI0_CLK_P)
HDMI0_D0_N: Module1.184(HDMI0_TX0_N)
HDMI0_D0_P: Module1.182(HDMI0_TX0_P)
HDMI0_D1_N: Module1.178(HDMI0_TX1_N)
HDMI0_D1_P: Module1.176(HDMI0_TX1_P)
HDMI0_D2_N: Module1.172(HDMI0_TX2_N)
HDMI0_D2_P: Module1.170(HDMI0_TX2_P)
HDMI0_HOTPLUG: Module1.153(HDMI0_HOTPLUG)
HDMI0_SCL: Module1.200(HDMI0_SCL)
HDMI0_SDA: Module1.199(HDMI0_SDA)
HDMI1_CEC: J5.13 Module1.149(HDMI1_CEC)
HDMI1_CK_N: J5.12 Module1.166(HDMI1_CLK_N)
HDMI1_CK_P: J5.10 Module1.164(HDMI1_CLK_P)
HDMI1_D0_N: J5.9 Module1.160(HDMI1_TX0_N)
HDMI1_D0_P: J5.7 Module1.158(HDMI1_TX0_P)
HDMI1_D1_N: J5.6 Module1.154(HDMI1_TX1_N)
HDMI1_D1_P: J5.4 Module1.152(HDMI1_TX1_P)
HDMI1_D2_N: J5.3 Module1.148(HDMI1_TX2_N)
HDMI1_D2_P: J5.1 Module1.146(HDMI1_TX2_P)
HDMI1_HOTPLUG: J5.19 Module1.143(HDMI1_HOTPLUG)
HDMI1_SCL: J5.15 Module1.147(HDMI1_SCL)
HDMI1_SDA: J5.16 Module1.145(HDMI1_SDA)
HDMI_5V: C7.2 J5.18 U1.2(OUT)
PCIE_CLK_N: J6.A14 Module1.112(PCIe_CLK_N)
PCIE_CLK_nREQ: J6.B12 Module1.102(PCIe_CLK_nREQ)
PCIE_CLK_P: J6.A13 Module1.110(PCIe_CLK_P)
PCIE_nRST: J6.A11 Module1.109(PCIe_nRST)
PCIE_RX_N: J6.A16 Module1.118(PCIe_RX_N)
PCIE_RX_P: J6.A17 Module1.116(PCIe_RX_P)
PCIE_TX_N: J6.B14 Module1.122(PCIe_TX_P)
PCIE_TX_P: J6.B15 Module1.124(PCIe_TX_N)
USB2_N: Module1.103(USB2_N) ; port USB2_N
USB2_P: Module1.105(USB2_P) ; port USB2_P
USBOTG_ID: Module1.101(USB_OTG_ID) ; port USBOTG_ID

Not connected (* = marked no-connect by the designer): J5 14*; J6 A1* A7* B5* B6* B11* B17*; Module1 104(Reserved)* 106(Reserved)* 111(VDAC_COMP)*

### Layout directives
differential pair; differential pair class D100: HDMI1_CK_N, HDMI1_CK_P, HDMI1_D0_N, HDMI1_D0_P, HDMI1_D1_N, HDMI1_D1_P, HDMI1_D2_N, HDMI1_D2_P, PCIE_CLK_N, PCIE_CLK_P, PCIE_RX_N, PCIE_RX_P, PCIE_TX_N, PCIE_TX_P
differential pair; differential pair class D90: USB2_N, USB2_P
net class PCIE: PCIE_CLK_N, PCIE_CLK_nREQ, PCIE_CLK_P, PCIE_RX_N, PCIE_RX_P, PCIE_TX_N, PCIE_TX_P
net class HDMI: HDMI1_CK_N, HDMI1_CK_P, HDMI1_D0_N, HDMI1_D0_P, HDMI1_D1_N, HDMI1_D1_P, HDMI1_D2_N, HDMI1_D2_P

### Notes on the sheet
- NB PCIe x1 takes a maximum of +12v @0.6A or +3.3v@3A , 10Watts combined
- TX and RX have PN swaps to improve routing
- 1
- 2
- 3
- 4
- 5
- 6
- A
- B
- C
- www.raspberrypi.com <http://www.raspberrypi.com>
- D
- Title: Compute Module 4 IO Board - CM4 - Highspeed
- File: CM4_HighSpeed.kicad_sch
- Sheet: /
- © 2020-2022 Raspberry Pi Ltd (formerly Raspberry Pi (Trading) Ltd.)
- KiCad E.D.A.  kicad (5.1.4)-1
- Size: A4
- Date:
- Rev: 1
- Id: 1/1
- (in symbol 208658-1001) D2+; GND; D2-; D1+; D1-; D0+; D0-; DCLK+; DCLK-; CEC; NC; DDC CLK; DDC DAT; +5V; HP_DET
- (in symbol RPi_CM4_1, part B) High Speed Serial

### Library data of the parts
C7 C8 = CC0603KRX7R9BB104: as C12 on sheet GrandMini_v1; Value: 0.1 µF; Part Number: CC0603KRX7R9BB104; Applications: General Purpose; Capacitance: 0.1 µF; componentlink1description: Datasheet; componentlink1url: https://www.yageo.com/upload/media/product/productsearch/datasheet/mlcc/UPY-GPHC_X7R_6.3V-to-50V_18.pdf; componentlink2description: DigiKey Link; componentlink2url: https://www.digikey.com/en/products/detail/yageo/CC0603KRX7R9BB104/2103082; Device Package: 0603 (1608 Metric); lastupdated: 09.02.2024 20:10:21; Lifecycle Status: Active; Minimum Order: 1; Mounting Type: Surface Mount, MLCC; Operating Temperature: -55°C ~ 125°C; Package / Case: 0603 (1608 Metric); packaging: TapeAndReel; partid: 9506; Part Status: Active; price: 0.01; series: CC; Size / Dimension: 0.063" L x 0.031" W (1.60mm x 0.80mm); Supplier 1: DigiKey; Supplier Part Number 1: 311-1344-1-ND; Temperature Coefficient: X7R; Thickness (Max): 0.035" (0.90mm); Voltage - Rated: 50V
C9 C10 = CC0805KKX5R8BB106: as C3 on sheet CM4_GPIO; Value: 10 µF; Part Number: CC0805KKX5R8BB106; Applications: General Purpose; Capacitance: 10 µF; componentlink1description: Datasheet; componentlink1url: https://www.yageo.com/upload/media/product/productsearch/datasheet/mlcc/UPY-GPHC_X5R_4V-to-50V_25.pdf; componentlink2description: DigiKey Link; componentlink2url: https://www.digikey.com/en/products/detail/yageo/CC0805KKX5R8BB106/5195275; Device Package: 0805 (2012 Metric); lastupdated: 09.02.2024 20:15:28; Lifecycle Status: Active; Minimum Order: 1; Mounting Type: Surface Mount, MLCC; Operating Temperature: -55°C ~ 85°C; Package / Case: 0805 (2012 Metric); packaging: TapeAndReel; partid: 16151; Part Status: Active; price: 0.06; series: CC; Size / Dimension: 0.079" L x 0.049" W (2.00mm x 1.25mm); Supplier 1: DigiKey; Supplier Part Number 1: 311-1869-1-ND; Temperature Coefficient: X5R; Thickness (Max): 0.057" (1.45mm); Voltage - Rated: 25V
C11 = T491X476K035AT: CAP TANT 47UF 10% 35V 2917; manufacturer: KEMET; Manufacturer Size Code: X; ESR (Equivalent Series Resistance): 600mOhm; Lifetime @ Temp.: 2000 Hrs @ 125°C; Type: Molded; Part Number: T491X476K035AT; Value: 47 µF; Capacitance: 47 µF; componentlink1description: Datasheet; componentlink1url: https://api.kemet.com/component-edge/download/datasheet/T491X476K035AT.pdf; componentlink2description: DigiKey Link; componentlink2url: https://www.digikey.com/en/products/detail/kemet/T491X476K035AT/818681; Device Package: 2917 (7343 Metric); Features: General Purpose; Height - Seated (Max): 0.169" (4.30mm); lastupdated: 03.06.2024 19:30:20; Lifecycle Status: Active; Minimum Order: 1; Mounting Type: Surface Mount; Operating Temperature: -55°C ~ 125°C; Package / Case: 2917 (7343 Metric); packaging: TapeAndReel; partid: 3168; Part Status: Active; price: 1.10; series: T491; Size / Dimension: 0.287" L x 0.169" W (7.30mm x 4.30mm); Supplier 1: DigiKey; Supplier Part Number 1: 399-3821-1-ND; Tolerance: ±10%; Voltage - Rated: 35 V
J5 = 208658-1001: Connector, HDMI; Manufacturer_Name: Molex; Datasheet Link: https://componentsearchengine.com/Datasheets/2/208658-1001.pdf; Height: 6.19mm; Manufacturer_Part_Number: 208658-1001; Mouser Part Number: 538-208658-1001; Mouser Price/Stock: https://www.mouser.co.uk/ProductDetail/Molex/208658-1001?qs=B6kkDfuK7%2FCPiHHdkGL5VQ%3D%3D
J6 = 10018783-11210TLF: Connector PCI-E; Manufacturer_Name: Amphenol Communications Solutions; Datasheet Link: https://cdn.amphenol-cs.com/media/wysiwyg/files/drawing/10018783.pdf; Height: 11.25mm; Manufacturer_Part_Number: 10018783-11210TLF
Module1 = RPi_CM4_1: Rapsberry PI Compute Module 4 +
U1 = RT9742SNGV: Part Description: Power Switch/Driver 1:1 N-Channel 500mA SOT-23-3; Field4: Farnell; Field5: 2575555; Field7: RichTek; Field8: USWI00155; Field6: RT9742SNGV; Value: RT9742SNGV; Footprint: Package_TO_SOT_SMD:SOT-23